# Altium schematic sheet [1]_Power Supply.SchDoc
size A3; DocumentNumber: 1; SheetNumber: 1; SheetTotal: 9; PageSetup: Record=PageOptions|CenterHorizontal=True|CenterVertical=True|PrintScale=0.97|XCorrection=1.00|YCorrection=1.00|PrintKind=1|BorderSize=5000000|LeftOffset=0|BottomOffset=0|Orientation=2|PaperLength=2970|PaperWidth=2100|Scale=100|PaperSource=7|PrintQuality=600|MediaType=1|DitherType=10|PaperKind=A4|PrintScaleMode=1
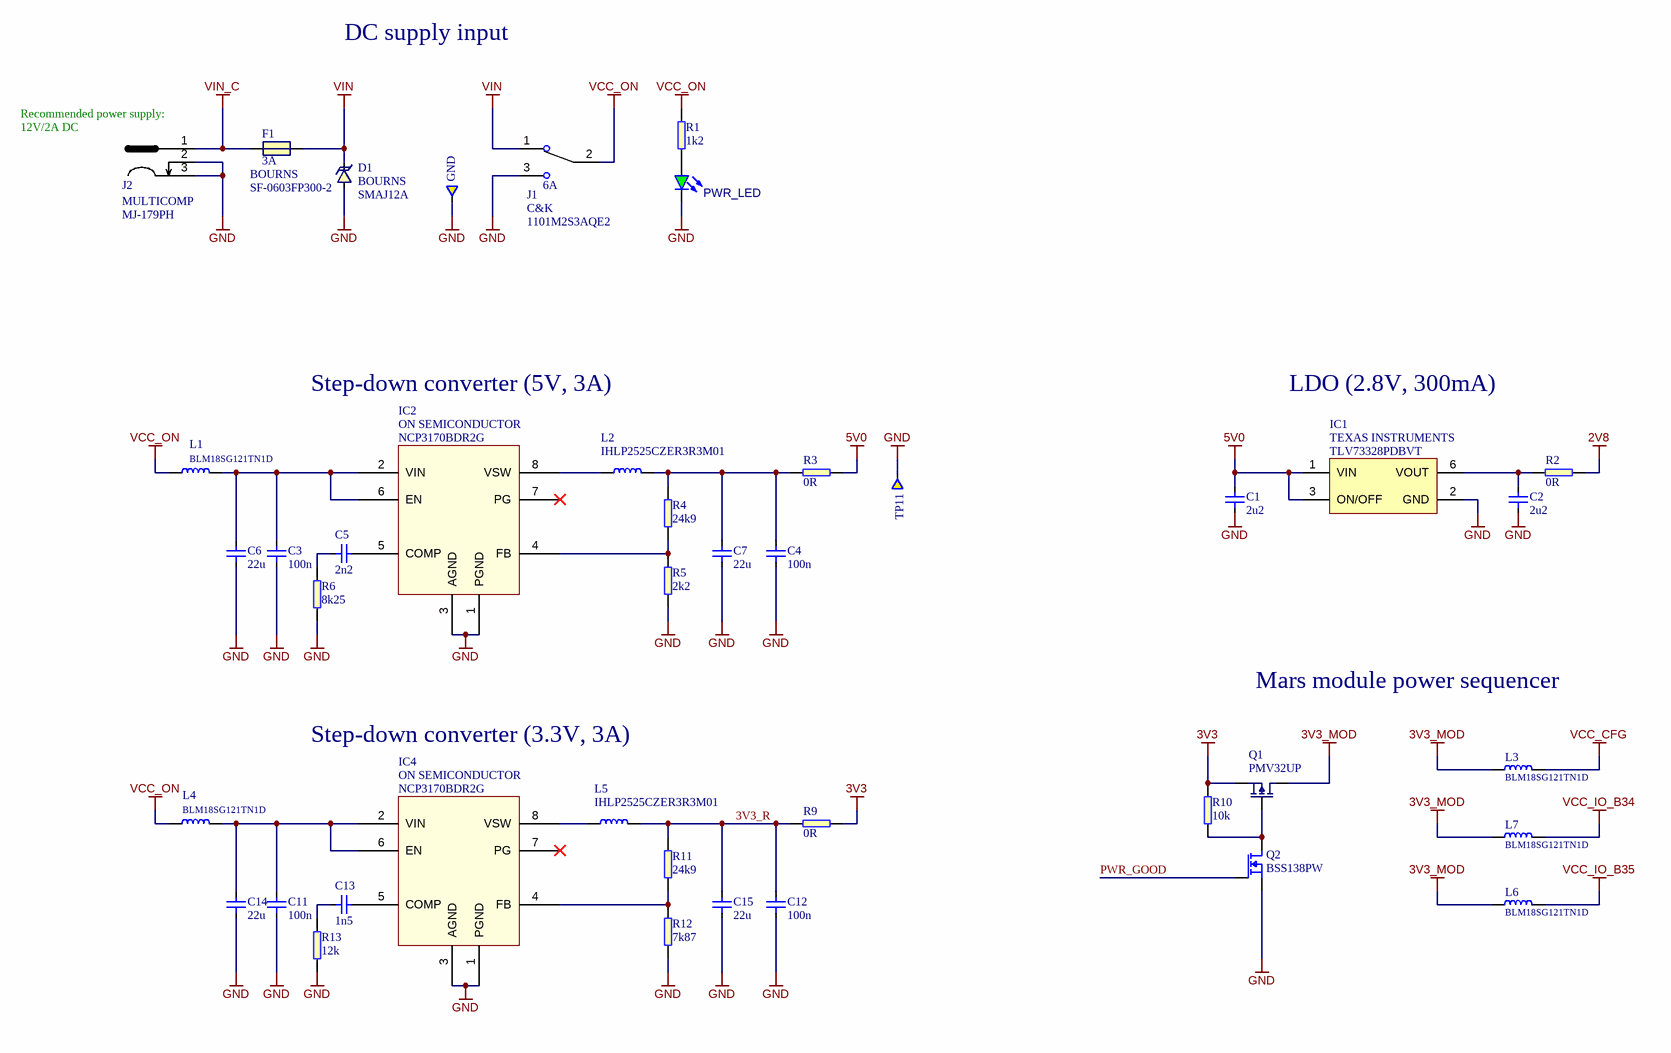
[diagram p0: [1]_Power Supply.SchDoc]

## Parts
C1  2u2  [0603]
C2  2u2  [0603]
C3  100n  [0402]
C4  100n  [0402]
C5  2n2  [0402]
C6  22u  [0805]
C7  22u  [0805]
C11  100n  [0402]
C12  100n  [0402]
C13  1n5  [0402]
C14  22u  [0805]
C15  22u  [0805]
D1  SMAJ12A  Manufacturer: BOURNS  [DO-214AA]
F1  3A  Manufacturer: BOURNS  Part Symbol: SF-0603FP300-2  [0603]
GND  Testpad  [TP-R-2]  (value not drawn)  (no BOM)
IC1  TLV73328PDBVT  Manufacturer: TEXAS INSTRUMENTS  [SOT23-5N]
IC2  NCP3170BDR2G  Manufacturer: ON SEMICONDUCTOR  [SOIC-8]
IC4  NCP3170BDR2G  Manufacturer: ON SEMICONDUCTOR  [SOIC-8]
J1  6A  Manufacturer: C&K  [1101M2S3AQE2]
J2  Manufacturer: MULTICOMP  Part Symbol: MJ-179PH  [DC_SOCKET]
L1  BLM18SG121TN1D  [0603]
L2  IHLP2525CZER3R3M01  [IHLP-2525CZ-01]
L3  BLM18SG121TN1D  [0603]
L4  BLM18SG121TN1D  [0603]
L5  IHLP2525CZER3R3M01  [IHLP-2525CZ-01]
L6  BLM18SG121TN1D  [0603]
L7  BLM18SG121TN1D  [0603]
PWR_LED  KPT-1608SGC  [LED0603]  (value not drawn)
Q1  PMV32UP  [SOT-23]
Q2  BSS138PW  [SC70-3]
R1  1k2  [0402]
R2  0R  [0603]
R3  0R  [0603]
R4  24k9  [0402]
R5  2k2  [0402]
R6  8k25  [0402]
R9  0R  [0603]
R10  10k  [0402]
R11  24k9  [0402]
R12  7k87  [0402]
R13  12k  [0402]
TP11  Testpad  [TP-R-2]  (value not drawn)  (no BOM)

## Nets
2V8: R2.2
3V3: Q1.2(S) R9.2 R10.2
3V3_MOD: L3.1 L6.1 L7.1 Q1.3(D)
5V0: C1.2 IC1.1(VIN) IC1.3(ON/OFF) R3.2
GND: C1.1 C2.1 C3.1 C4.1 C6.1 C7.1 C11.1 C12.1 C14.1 C15.1 D1.A GND.1 IC1.2(GND) IC2.1(PGND) IC2.3(AGND) IC4.1(PGND) IC4.3(AGND) J1.3 J2.2 J2.3 PWR_LED.K Q2.2(S) R5.1 R6.1 R12.1 R13.1 TP11.1
VCC_CFG: L3.2
VCC_IO_B34: L7.2
VCC_IO_B35: L6.2
VCC_ON: J1.2 L1.1 L4.1 R1.2
VIN: D1.C F1.2 J1.1
VIN_C: F1.1 J2.1
3V3_R: C12.2 C15.2 L5.2 R9.1 R11.2
PWR_GOOD: Q2.1(G)
NetC2_2: C2.2 IC1.6(VOUT) R2.1
NetC3_2: C3.2 C6.2 IC2.2(VIN) IC2.6(EN) L1.2
NetC4_2: C4.2 C7.2 L2.2 R3.1 R4.2
NetC5_1: C5.1 R6.2
NetC5_2: C5.2 IC2.5(COMP)
NetC11_2: C11.2 C14.2 IC4.2(VIN) IC4.6(EN) L4.2
NetC13_1: C13.1 R13.2
NetC13_2: C13.2 IC4.5(COMP)
NetIC2_4: IC2.4(FB) R4.1 R5.2
NetIC2_8: IC2.8(VSW) L2.1
NetIC4_4: IC4.4(FB) R11.1 R12.2
NetIC4_8: IC4.8(VSW) L5.1
NetPWR_LED_A: PWR_LED.A R1.1
NetQ1_1: Q1.1(G) Q2.3(D) R10.1

Not connected (* = marked no-connect by the designer): IC2 7(PG)*; IC4 7(PG)*

## Notes on the sheet
- DC supply input
- (near J2) Recommended power supply:
- 12V/2A DC
- Step-down converter (5V, 3A)
- LDO (2.8V, 300mA)
- Mars module power sequencer
- Step-down converter (3.3V, 3A)
- Title:
- Size:
- Date:
- A3
- Revision:
- Page:
- of
- Antmicro Ltd.
- File:
- www.antmicro.com

## Library data of the parts
C1 C2 = C_2u2_0603: MLCC SMT Capacitor 2u2F 0603; Manufacturer: TDK; Part Symbol: C1608X5R1V225K080AC; Voltage: 35V; Tolerance: +-10%; Part Number: C_2u2_0603; Value: 2u2
C3 C4 C11 C12 = C_100n_0402: MLCC SMT Capacitor 100nF 0402; Manufacturer: MULTICOMP; Part Symbol: MC0402X104M100CT; Voltage: 10V; Tolerance: +-20%; Part Number: C_100n_0402; Value: 100n
C5 = C_2n2_0402: MLCC SMT Capacitor 2n2 0402; Manufacturer: KEMET; Part Symbol: C0402C222J3GACTU; Voltage: 25V; Tolerance: +-5%; Part Number: C_2n2_0402; Value: 2n2
C6 C7 C14 C15 = C_22u_0805: MLCC SMT Capacitor 22uF 0805; Manufacturer: MULTICOMP; Part Symbol: MC0805X226M6R3CT; Voltage: 6.3V; Tolerance: +-20%; Part Number: C_22u_0805; Value: 22u
C13 = C_1n5_0402: MLCC SMT Capacitor 1.5 nF 0402; Manufacturer: WURTH ELEKTRONIK; Part Symbol: 885012205007; Voltage: 10V; Tolerance: +-10%; Part Number: C_1n5_0402; Value: 1n5
D1 = TVS_UNIDIR: DIODE, TVS, 12V, 400W; Part Number: SMAJ12A; Value: SMAJ12A; Part Symbol: SMAJ12A
F1 = Fuse: Fuse, Surface Mount,  SinglFuse SF-0603FP Series, 3 A, 32 VDC, Fast Acting, 0603; Part Number: SF-0603FP300-2; Value: 3A
GND TP11 = Testpad: Testpad, round, 2mm; Part Number: TP-R-2
IC1 = TLV73328PDBVT: Capacitor-Free, 300-mA, Low-Dropout Regulator with Foldback Current Limit for Portable Devices; Part Number: TLV73328PDBVT; Value: TLV73328PDBVT; Part Symbol: TLV73328PDBVT
IC2 IC4 = NCP3170BDR2G: DC-DC buck (step-down), reg., 4.5V-18Vin, Vou 1.25V-5V/3A, 1 MHz, SOIC-8; Part Number: NCP3170BDR2G; Value: NCP3170BDR2G; Part Symbol: NCP3170BDR2G
J1 = 1101M2S3AQE2: single-pole double-throw (SPDT) PC mount vertical Miniature Slide Switch with right angle through-hole termination; Part Number: SPDT Switch; Value: 6A; Part Symbol: 1101M2S3AQE2
J2 = DC_SOCKET: Part Number: DC_SOCKET
L1 L3 L4 L6 L7 = BLM18SG121TN1D: FERRITE BEAD, 0.025OHM, 3A, 0603; Manufacturer: MURATA; Part Number: BLM18SG121TN1D; Value: BLM18SG121TN1D; Part Symbol: BLM18SG121TN1D
L2 L5 = Inductor Power: 3.3 µH, ± 20%, Shielded, 0.02 ohm, 8 A; Manufacturer: VISHAY; Part Number: IHLP2525CZER3R3M01; Value: IHLP2525CZER3R3M01; Part Symbol: IHLP2525CZER3R3M01
PWR_LED = LED: LED Green 0603 case; Part Number: LED_G; Manufacturer: KINGBRIGHT; Value: KPT-1608SGC; Part Symbol: KPT-1608SGC
Q1 = PMOS: P CH, 20V, 4A; Manufacturer: NXP; Part Number: PMV32UP; Value: PMV32UP; Part Symbol: PMV32UP
Q2 = NMOS: MOSFET, N CH, 60V, 0.2A; Manufacturer: NXP; Value: BSS138PW; Part Number: BSS138PW; Part Symbol: BSS138PW
R1 = R_1k2_0402: SMT Resistor 1k2 0402; Manufacturer: PANASONIC; Part Symbol: ERJ2RKF1201X; Tolerance: 1%; Part Number: R_1k2_0402; Value: 1k2
R2 R3 R9 = R_0R_0603: SMT Resistor 0R 0603; Manufacturer: BOURNS; Part Symbol: CR0603-J/-000ELF; Tolerance: 5%; Part Number: R_0R_0603; Value: 0R
R4 R11 = R_24k9_0402: SMT Resistor 24k9 0402; Manufacturer: WALSIN; Part Symbol: WR04X2492FTL; Tolerance: 1%; Part Number: R_24k9_0402; Value: 24k9
R5 = R_4k7_0402: SMT Resistor 4k7 0402; Manufacturer: PANASONIC ELECTRONIC COMPONENTS; Part Symbol: ERJ2GEJ472X; Tolerance: 5%; Part Number: R_4k7_0402; Value: 2k2
R6 = R_8k25_0402: SMT Resistor 8k25 0402; Manufacturer: PANASONIC; Part Symbol: ERJ2RKF8251X; Tolerance: 1%; Part Number: R_8k25_0402; Value: 8k25
R10 = R_10k_0402: SMT Resistor 10k 0402; Manufacturer: MULTICOMP; Part Symbol: MCMR04X1002FTL; Tolerance: 1%; Part Number: R_10k_0402; Value: 10k
R12 = R_7k87_0402: SMT Resistor 7k87 0402; Manufacturer: MULTICOMP; Part Symbol: MCMR04X7871FTL; Tolerance: 1%; Part Number: R_7k87_0402; Value: 7k87
R13 = R_12k_0402: SMT Resistor 12k 0402; Manufacturer: VISHAY; Part Symbol: CRCW040212K0FKEDHP; Tolerance: 1%; Part Number: R_12k_0402; Value: 12k